# Altium schematic sheet High Freq.SchDoc
size A4; SheetNumber: 5; SheetTotal: 5
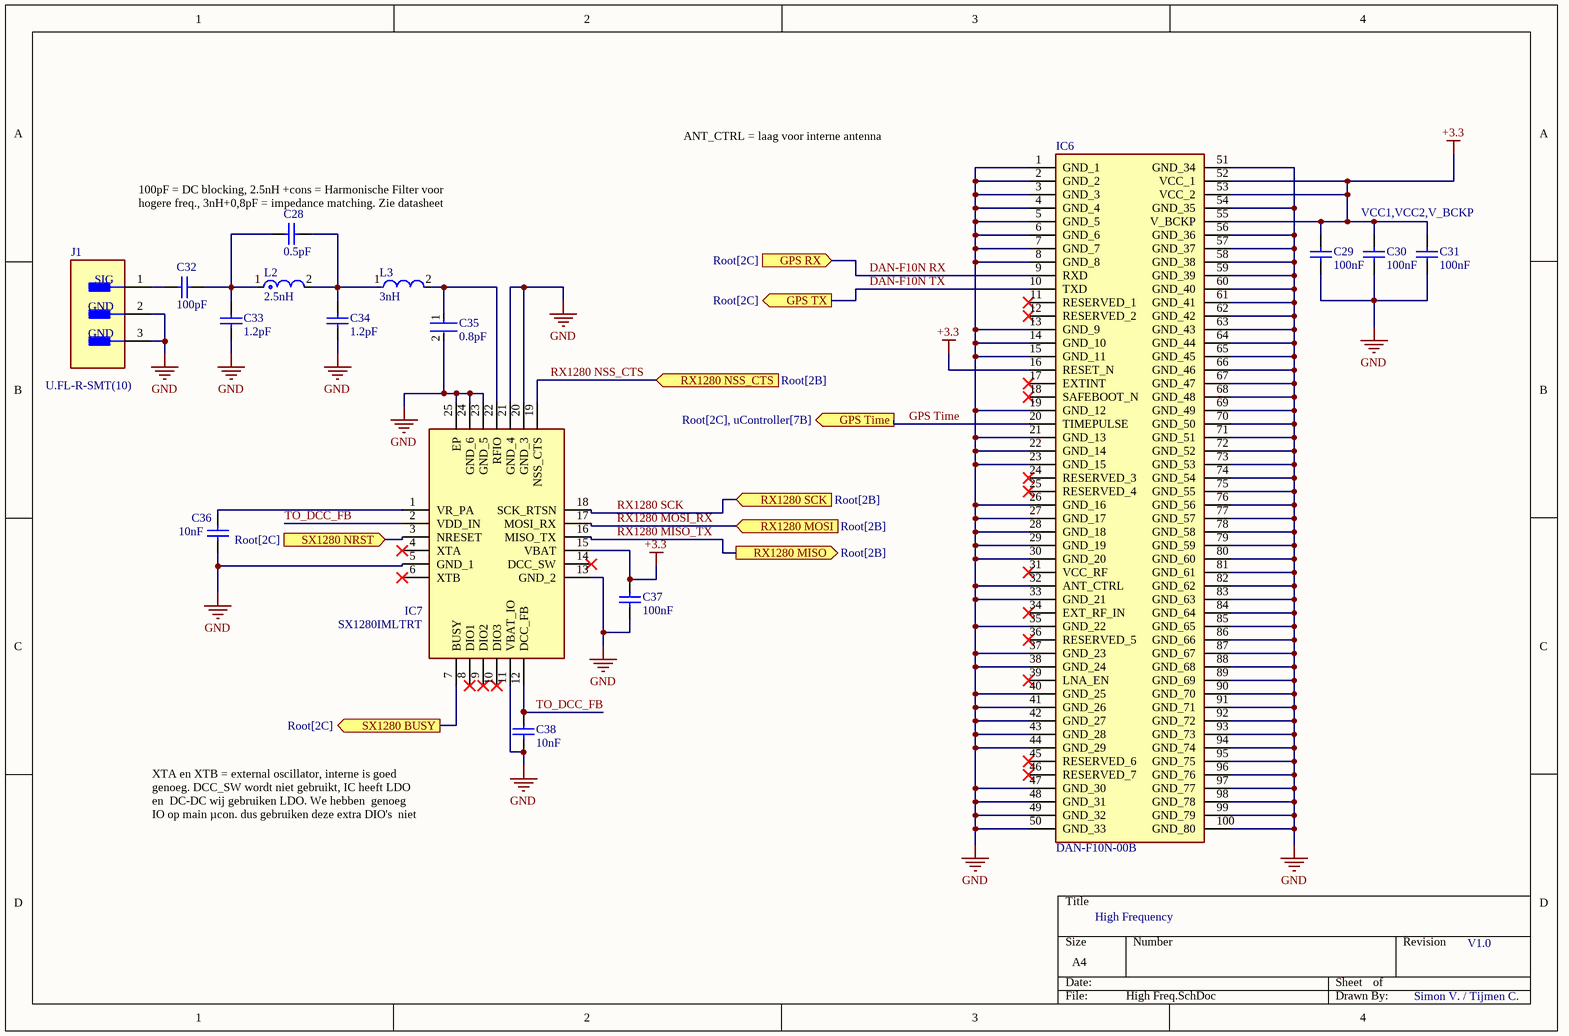
[diagram p0: High Freq.SchDoc]

## Parts
C28  0.5pF  [CAPC0603(1608)100_M]
C29  100nF  [CAPC1608X92X38ML15T08]
C30  100nF  [CAPC1608X92X38ML15T08]
C31  100nF  [CAPC1608X92X38ML15T08]
C32  100pF  [CAPC1608X92X38NL15T08]
C33  1.2pF  [CAPC1608X90X35NL15T15]
C34  1.2pF  [CAPC1608X90X35NL15T15]
C35  0.8pF  [FP-GCM188-0_1-IPC_C]
C36  10nF  [CAPC1608X92X38LL15T08]
C37  100nF  [CAPC1608X92X38ML15T08]
C38  10nF  [CAPC1608X92X38LL15T08]
IC6  DAN-F10N-00B  [DANF10N00B]
IC7  SX1280IMLTRT  [QFN50P400X400X100-25N-D]
J1  U.FL-R-SMT(10)  [FP-U_FL-R-SMT_10-MFG]
L2  2.5nH  [FP-LQP03TG_02-IPC_A]
L3  3nH  [FP-LQW18AN_80-MFG]

## Ports
GPS RX (in, see Root[2C]), GPS Time (out, see Root[2C], uController[7B]), GPS TX (out, see Root[2C]), RX1280 MISO (out, see Root[2B]), RX1280 MOSI (in, see Root[2B]), RX1280 NSS_CTS (in, see Root[2B]), RX1280 SCK (in, see Root[2B]), SX1280 BUSY (out, see Root[2C]), SX1280 NRST (in, see Root[2C])

## Nets
+3.3: C29.2 C30.2 C31.2 C37.2 IC6.16(RESET_N) IC6.52(VCC_1) IC6.53(VCC_2) IC6.55(V_BCKP) IC7.15(VBAT)
GND: C29.1 C30.1 C31.1 C33.1 C34.1 C35.2 C36.1 C37.1 C38.1 IC6.1(GND_1) IC6.2(GND_2) IC6.3(GND_3) IC6.4(GND_4) IC6.5(GND_5) IC6.6(GND_6) IC6.7(GND_7) IC6.8(GND_8) IC6.13(GND_9) IC6.14(GND_10) IC6.15(GND_11) IC6.19(GND_12) IC6.21(GND_13) IC6.22(GND_14) IC6.23(GND_15) IC6.26(GND_16) IC6.27(GND_17) IC6.28(GND_18) IC6.29(GND_19) IC6.30(GND_20) IC6.32(ANT_CTRL) IC6.33(GND_21) IC6.35(GND_22) IC6.37(GND_23) IC6.38(GND_24) IC6.40(GND_25) IC6.41(GND_26) IC6.42(GND_27) IC6.43(GND_28) IC6.44(GND_29) IC6.47(GND_30) IC6.48(GND_31) IC6.49(GND_32) IC6.50(GND_33) IC6.51(GND_34) IC6.54(GND_35) IC6.56(GND_36) IC6.57(GND_37) IC6.58(GND_38) IC6.59(GND_39) IC6.60(GND_40) IC6.61(GND_41) IC6.62(GND_42) IC6.63(GND_43) IC6.64(GND_44) IC6.65(GND_45) IC6.66(GND_46) IC6.67(GND_47) IC6.68(GND_48) IC6.69(GND_49) IC6.70(GND_50) IC6.71(GND_51) IC6.72(GND_52) IC6.73(GND_53) IC6.74(GND_54) IC6.75(GND_55) IC6.76(GND_56) IC6.77(GND_57) IC6.78(GND_58) IC6.79(GND_59) IC6.80(GND_60) IC6.81(GND_61) IC6.82(GND_62) IC6.83(GND_63) IC6.84(GND_64) IC6.85(GND_65) IC6.86(GND_66) IC6.87(GND_67) IC6.88(GND_68) IC6.89(GND_69) IC6.90(GND_70) IC6.91(GND_71) IC6.92(GND_72) IC6.93(GND_73) IC6.94(GND_74) IC6.95(GND_75) IC6.96(GND_76) IC6.97(GND_77) IC6.98(GND_78) IC6.99(GND_79) IC6.100(GND_80) IC7.5(GND_1) IC7.11(VBAT_IO) IC7.13(GND_2) IC7.20(GND_3) IC7.21(GND_4) IC7.23(GND_5) IC7.24(GND_6) IC7.25(EP) J1.2(GND) J1.3(GND)
DAN-F10N RX: IC6.9(RXD) ; port GPS RX
DAN-F10N TX: IC6.10(TXD) ; port GPS TX
GPS Time: IC6.20(TIMEPULSE) ; port GPS Time
RX1280 MISO_TX: IC7.16(MISO_TX) ; port RX1280 MISO
RX1280 MOSI_RX: IC7.17(MOSI_RX) ; port RX1280 MOSI
RX1280 NSS_CTS: IC7.19(NSS_CTS) ; port RX1280 NSS_CTS
RX1280 SCK: IC7.18(SCK_RTSN) ; port RX1280 SCK
SX1280 BUSY: IC7.7(BUSY) ; port SX1280 BUSY
SX1280 NRST: IC7.3(NRESET) ; port SX1280 NRST
TO_DCC_FB: C38.2 IC7.2(VDD_IN) IC7.12(DCC_FB)
NetC28_1: C28.1 C32.2 C33.2 L2.1
NetC28_2: C28.2 C34.2 L2.2 L3.1
NetC32_1: C32.1 J1.1(SIG)
NetC35_1: C35.1 IC7.22(RFIO) L3.2
NetC36_2: C36.2 IC7.1(VR_PA)

Not connected (* = marked no-connect by the designer): IC6 11(RESERVED_1)* 12(RESERVED_2)* 17(EXTINT)* 18(SAFEBOOT_N)* 24(RESERVED_3)* 25(RESERVED_4)* 31(VCC_RF)* 34(EXT_RF_IN)* 36(RESERVED_5)* 39(LNA_EN)* 45(RESERVED_6)* 46(RESERVED_7)*; IC7 4(XTA)* 6(XTB)* 8(DIO1)* 9(DIO2)* 10(DIO3)* 14(DCC_SW)*

## Notes on the sheet
- ANT_CTRL = laag voor interne antenna
- (near C28) 100pF = DC blocking, 2.5nH +cons = Harmonische Filter voor hogere freq., 3nH+0,8pF = impedance matching. Zie datasheet
- VCC1,VCC2,V_BCKP
- XTA en XTB = external oscillator, interne is goed genoeg. DCC_SW wordt niet gebruikt, IC heeft LDO en  DC-DC wij gebruiken LDO. We hebben  genoeg IO op main µcon. dus gebruiken deze extra DIO's  niet
- High Frequency
- V1.0
- Simon V. / Tijmen C.

## Library data of the parts
C28 = CMP-1035-00001-1: CAP 0.5pF 10V ±0.1pF 0603 (1608 Metric) Thickness 1mm SMD; Case-EIA: 0603; Case-Metric: 1608; Tolerance: Â±0.1pF; Max Thickness: 1 mm; Value: 0.5pF; Technology: SMT; Rated Voltage: 10 V
C29-C31 C37 = CMP-2006-01140-1: Part Number: VJ0603Y104MXXAC; Manufacturer: Vitramon
C32 = CMP-2006-01145-1: Manufacturer: Vitramon; Part Number: VJ0603A101KXCAC
C33 C34 = CMP-2006-04009-1: Manufacturer: AVX Interconnect / Elco; Part Number: 06031A1R2CAT2A
C35 = CMP-06035-009191-1: Ceramic Capacitor for Automotive 0.8pF  ±0.1pF 100VDC C0G 0603 Paper T/R
C36 C38 = CMP-2006-01201-1: Manufacturer: Vitramon; Part Number: VJ0603Y103JXXAC
IC6 = DAN-F10N-00B: Integrated Circuit; Manufacturer_Name: u-blox; Datasheet Link: https://content.u-blox.com/sites/default/files/documents/DAN-F10N_DataSheet_UBXDOC-963802114-13074.pdf; Height: 12.4mm; Manufacturer_Part_Number: DAN-F10N-00B
IC7 = SX1280IMLTRT: Integrated Circuit; Manufacturer_Name: SEMTECH; Datasheet Link: https://datasheet.datasheetarchive.com/originals/distributors/DKDS-37/728740.pdf; Height: 1mm; Manufacturer_Part_Number: SX1280IMLTRT; Mouser Part Number: 947-SX1280IMLTRT; Mouser Price/Stock: https://www.mouser.co.uk/ProductDetail/Semtech/SX1280IMLTRT?qs=5aG0NVq1C4xuoq8G6ZzdxQ%3D%3D; Arrow Part Number: SX1280IMLTRT; Arrow Price/Stock: https://www.arrow.com/en/products/sx1280imltrt/semtech?utm_currency=USD&region=nac
J1 = CMP-0029-00003-2: CONN U.FL RCPT STR 50 OHM SMD; Plating: Silver; Connector Type: Coaxial; Frequency: 6GHz; Impedance: 50R; Body Material: Bronze; Dielectric Material: Polymer; Contact Plating: Gold; Termination: Solder; Orientation: Vertical; Contact Material: Brass; Min Operating Temperature: -40°C; Mount: Surface Mount; Lead Free: Lead Free; Max Operating Temperature: 90°C; Radiation Hardening: No; Packaging: Tape and Reel; Body Plating: Silver; Fastening Type: Snap; Max Frequency: 6GHz; Depth: 3.1mm; Package Quantity: 1; Case/Package: SMD/SMT; Housing Color: Beige; Length: 3mm
L2 = CMP-06042-004686-1: Film type RF Inductor 2.5nH ±0.1nH 500mA 0.2Ω 0201 (0603); Self Resonant Frequency: 10GHz; Shielding: Unshielded; Core Material: Non-Magnetic; Test Frequency: 500MHz; Q Factor: 14; DC Resistance (DCR): 200mR; Package Quantity: 15000; Resistor Type: Thin Film; Max DC Current: 500mA; Lead Free: Lead Free; Packaging: Tape and Reel; Height - Seated (Max): 0.013inch; Inductance: 2.5nH; Width: 0.012inch; Termination: SMD/SMT; Case Code (Imperial): 0201; Mount: Surface Mount; Max Operating Temperature: 125°C; Height: 0.3mm; Min Operating Temperature: -55°C; Case Code (Metric): 0603; Length: 0.024inch; Current Rating: 500mA; Case/Package: 0201
L3 = CMP-06042-001485-1: Wire Wound RF Inductor 3nH ±0.2nH 670mA 0.17Ω 0603 (1608); Shielding: Unshielded; Core Material: Non-Magnetic; DC Resistance (DCR): 170mR; Self Resonant Frequency: 15GHz; Test Frequency: 100MHz; Q Factor: 13; Packaging: Tape and Reel; Case Code (Imperial): 0603; Case Code (Metric): 1608; Length: 0.065inch; Min Operating Temperature: -55°C; Height - Seated (Max): 0.039inch; Current Rating: 670mA; Case/Package: 0603; Resistor Type: Wirewound; Weight: 7.1E-05oz; Max Operating Temperature: 125°C; Max DC Current: 670mA; Package Quantity: 4000; Inductance: 3nH; Width: 0.99mm; Mount: Surface Mount; Height: 0.9mm; Termination: SMD/SMT